# EAGLE schematic interactiveBoard (EAGLE 9.5.2)
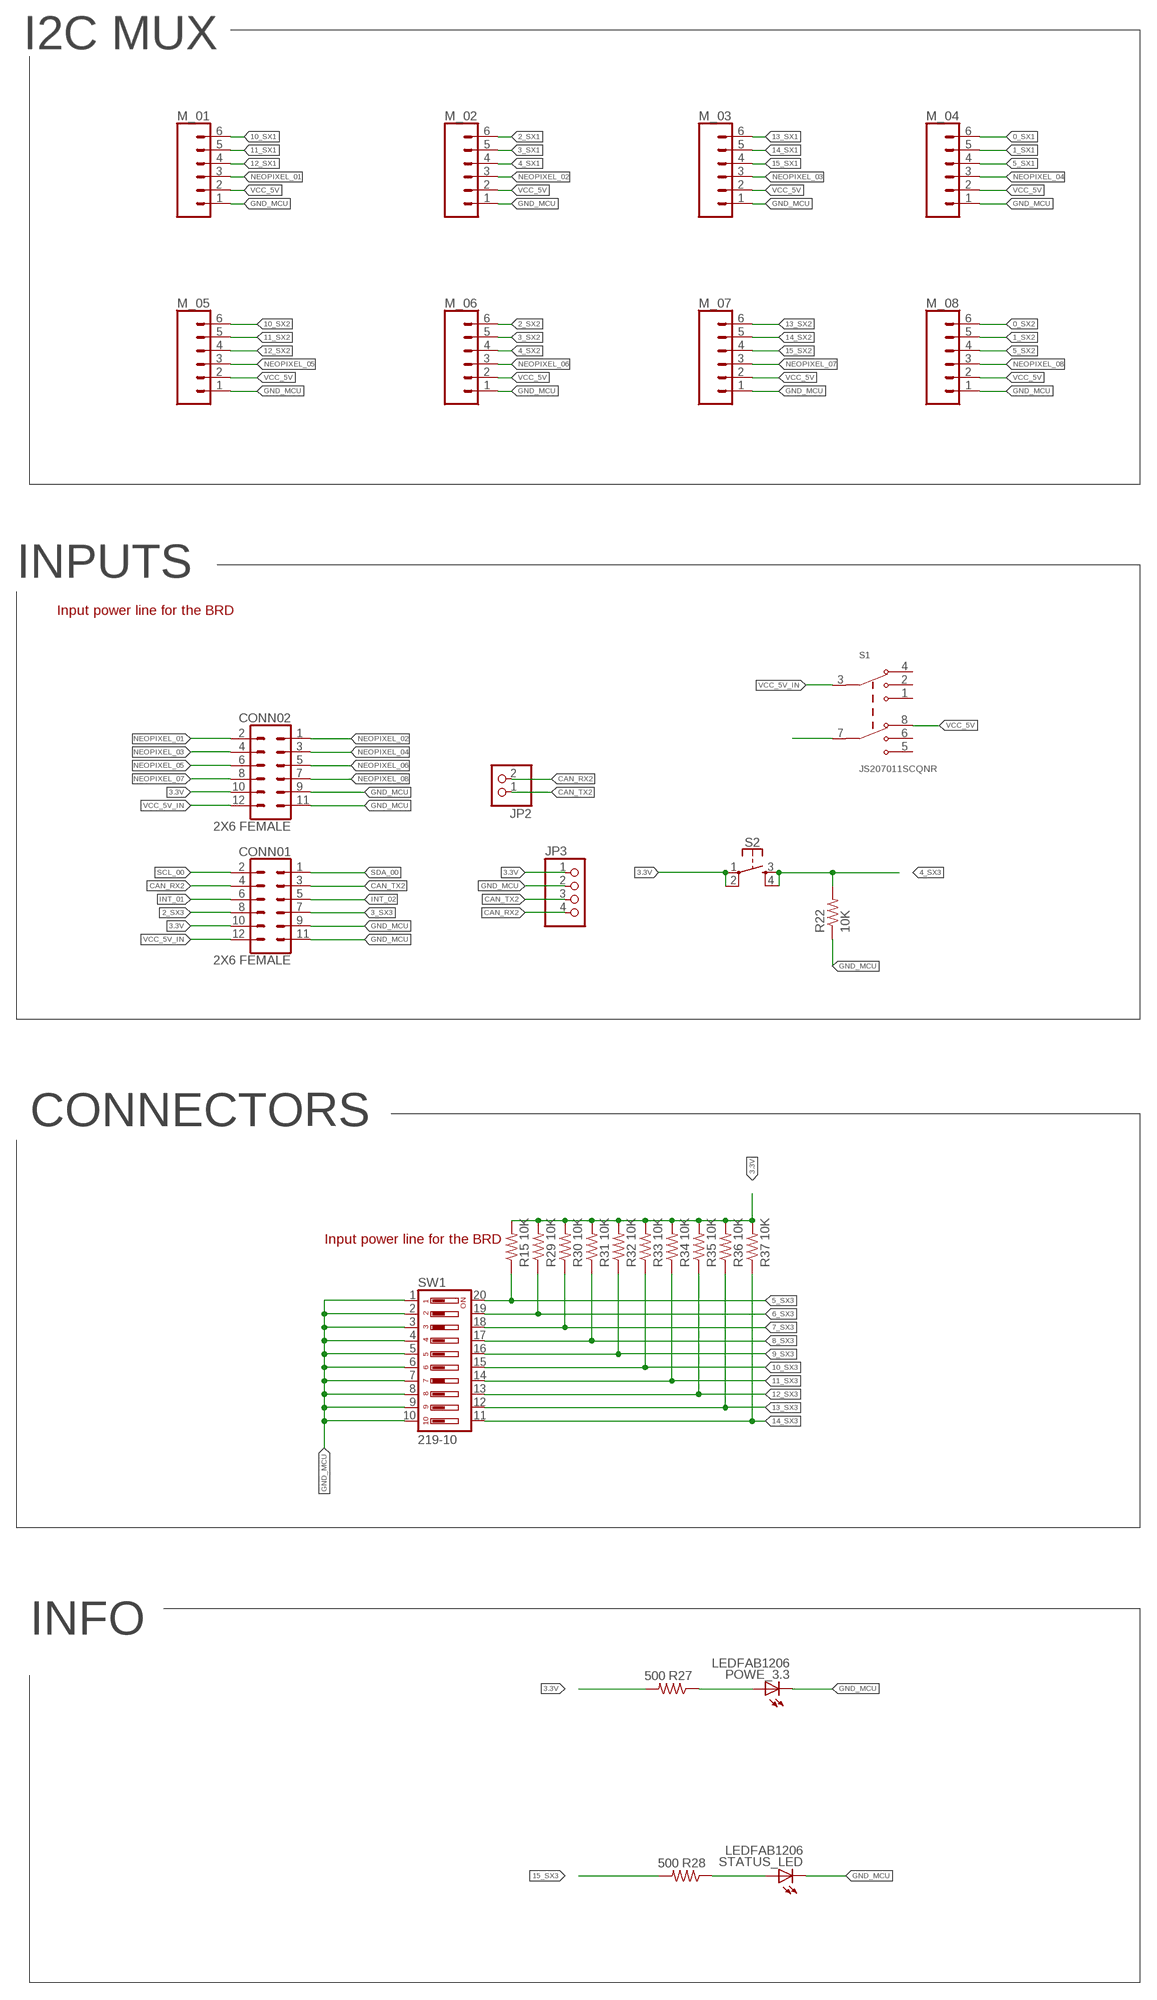
[diagram p0: schematic, sheet 1, part 1 of 2]
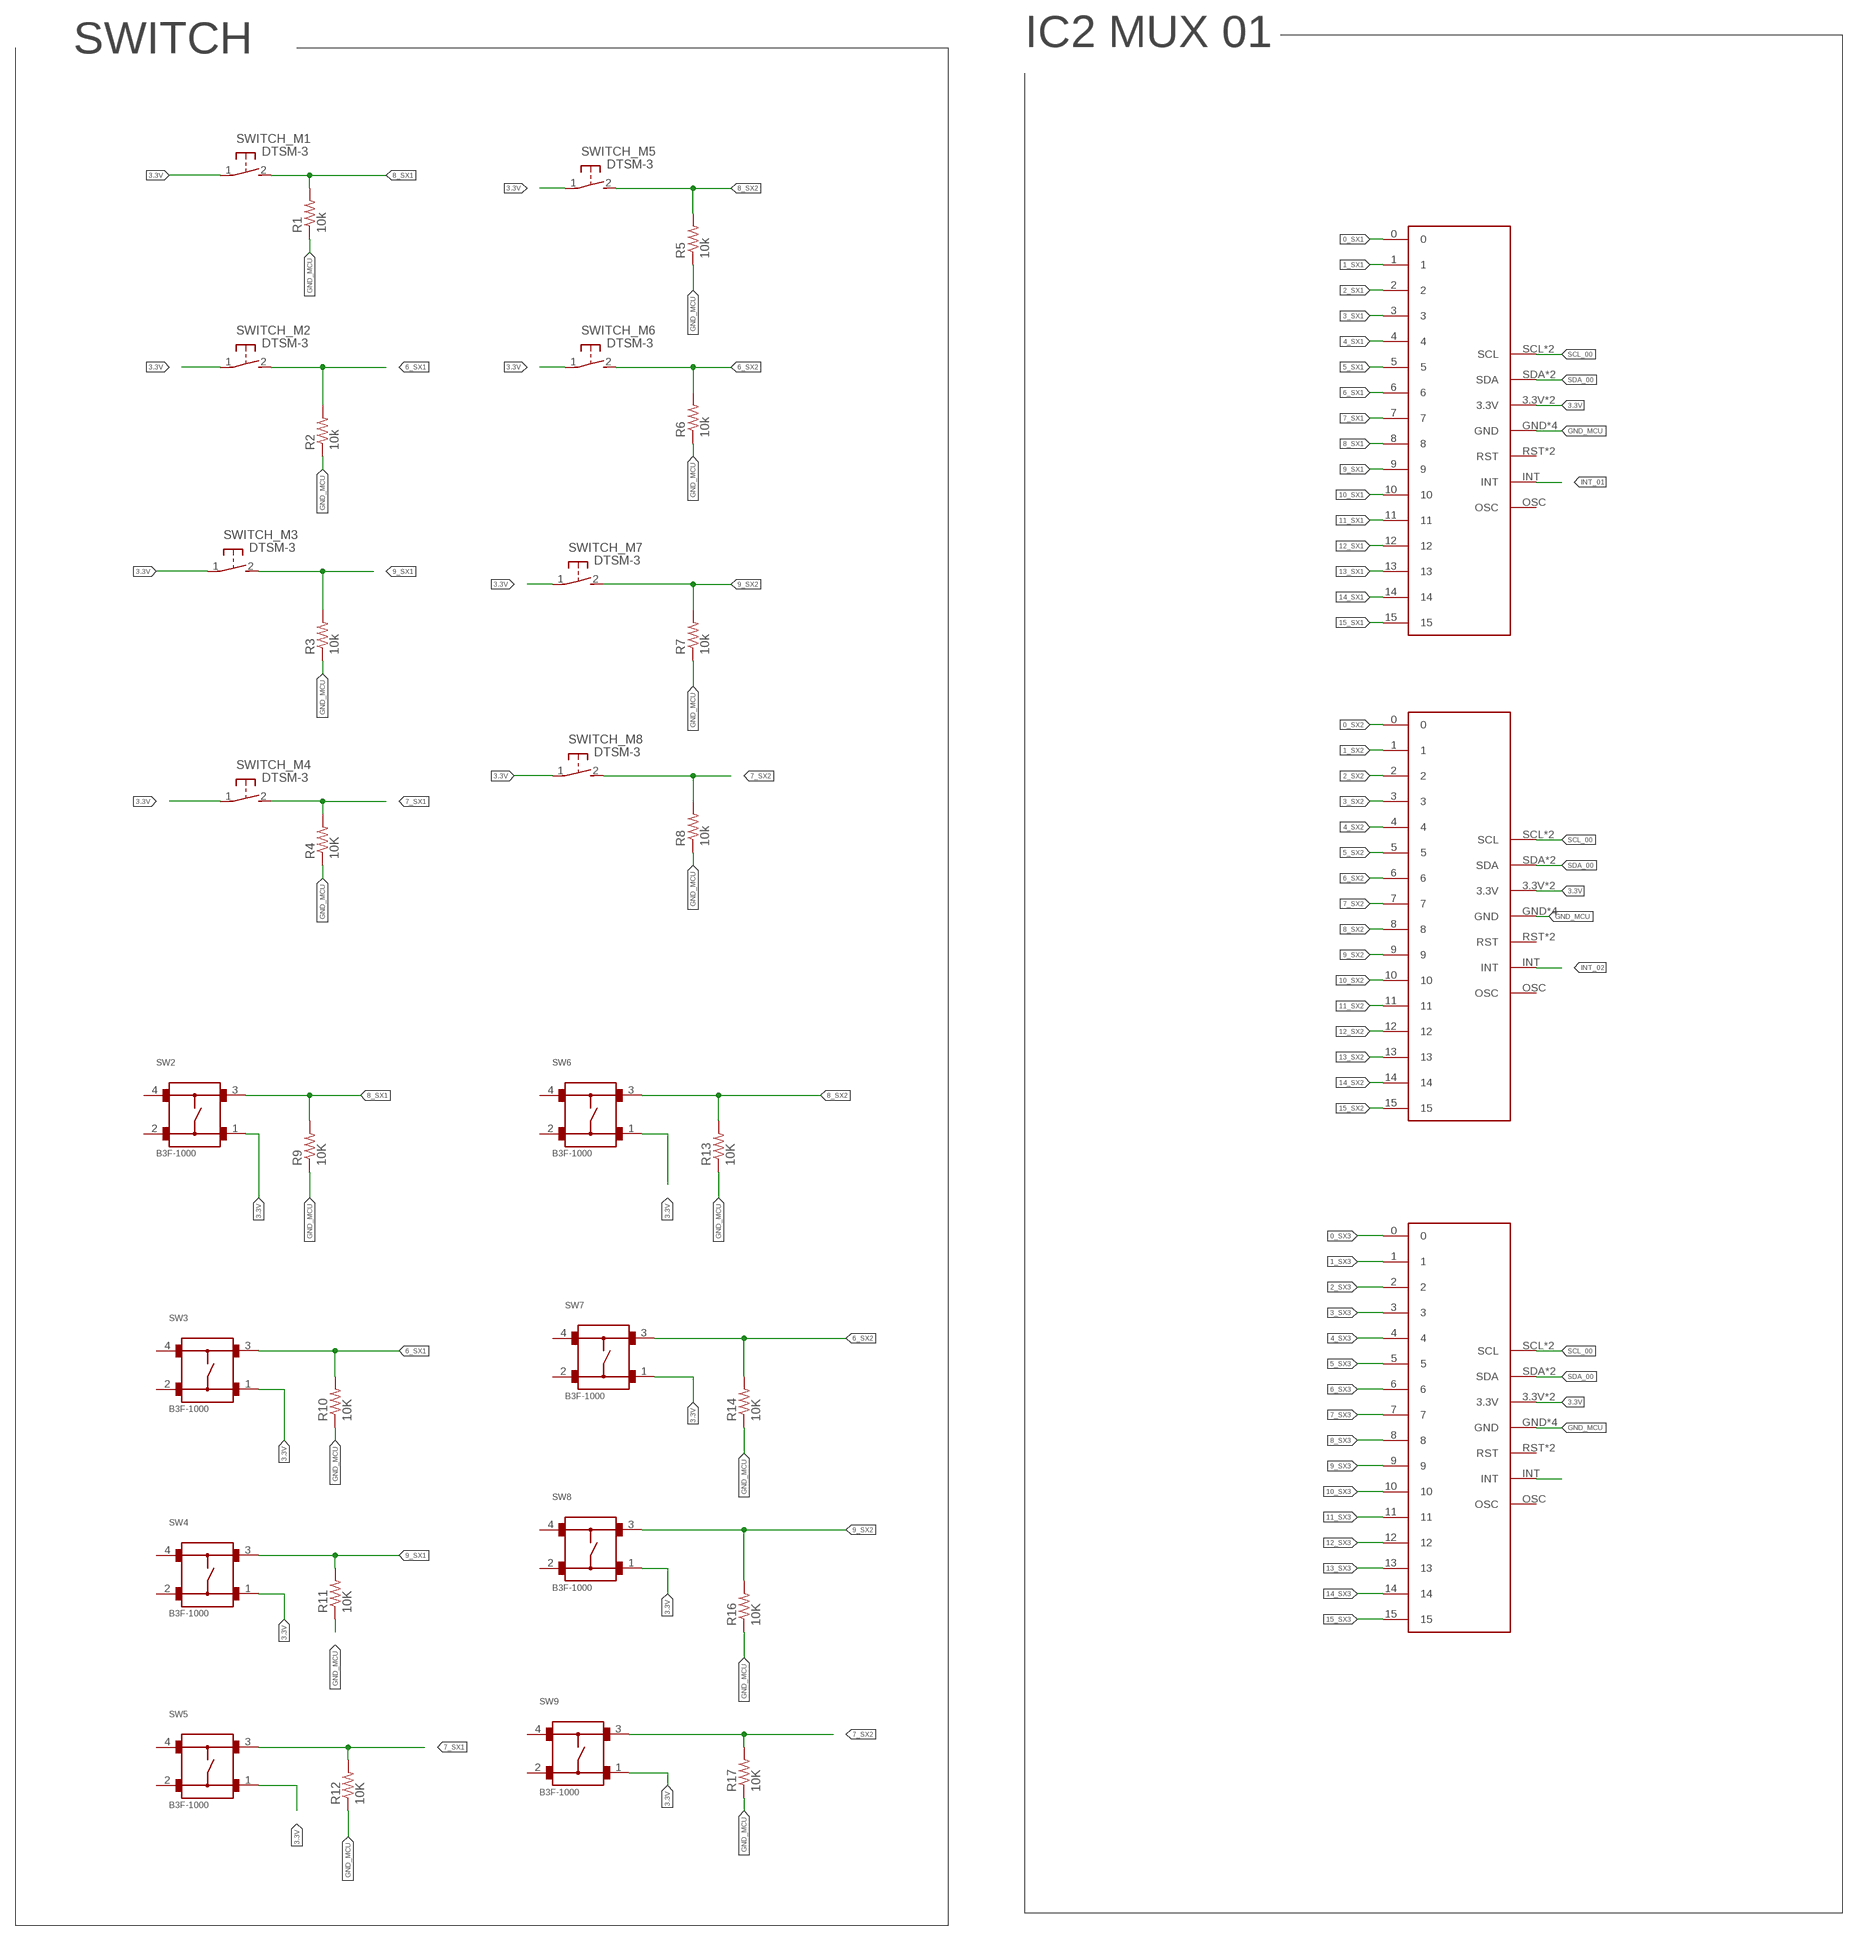
[diagram p1: schematic, sheet 1, part 2 of 2]

## Parts
CONN01  2X6 FEMALE  CONN_06X2PTH_FEMALE  [2X6]
CONN02  2X6 FEMALE  CONN_06X2PTH_FEMALE  [2X6]
JP2  HEADER-1X2ROUND  [1X02_ROUND]
JP3  HEADER-1X4ROUND  [1X04_ROUND]
M_01  CONN_06SMD-1MM  [1X06-1MM]
M_02  CONN_06SMD-1MM  [1X06-1MM]
M_03  CONN_06SMD-1MM  [1X06-1MM]
M_04  CONN_06SMD-1MM  [1X06-1MM]
M_05  CONN_06SMD-1MM  [1X06-1MM]
M_06  CONN_06SMD-1MM  [1X06-1MM]
M_07  CONN_06SMD-1MM  [1X06-1MM]
M_08  CONN_06SMD-1MM  [1X06-1MM]
POWE_3.3  LEDFAB1206  [LED1206FAB]
R1  10k  R-US_M0805  [M0805]
R2  10k  R-US_M0805  [M0805]
R3  10k  R-US_M0805  [M0805]
R4  10K  R-US_M0805  [M0805]
R5  10k  R-US_M0805  [M0805]
R6  10k  R-US_M0805  [M0805]
R7  10k  R-US_M0805  [M0805]
R8  10k  R-US_M0805  [M0805]
R9  10K  R-US_M0805  [M0805]
R10  10K  R-US_M0805  [M0805]
R11  10K  R-US_M0805  [M0805]
R12  10K  R-US_M0805  [M0805]
R13  10K  R-US_M0805  [M0805]
R14  10K  R-US_M0805  [M0805]
R15  10K  10KOHM-1/10W-1%(0603)0603  [0603-RES]
R16  10K  R-US_M0805  [M0805]
R17  10K  R-US_M0805  [M0805]
R22  10K  R-US_M0805  [M0805]
R27  500  10KOHM-1/10W-1%(0603)0603  [0603-RES]
R28  500  10KOHM-1/10W-1%(0603)0603  [0603-RES]
R29  10K  10KOHM-1/10W-1%(0603)0603  [0603-RES]
R30  10K  10KOHM-1/10W-1%(0603)0603  [0603-RES]
R31  10K  10KOHM-1/10W-1%(0603)0603  [0603-RES]
R32  10K  10KOHM-1/10W-1%(0603)0603  [0603-RES]
R33  10K  10KOHM-1/10W-1%(0603)0603  [0603-RES]
R34  10K  10KOHM-1/10W-1%(0603)0603  [0603-RES]
R35  10K  10KOHM-1/10W-1%(0603)0603  [0603-RES]
R36  10K  10KOHM-1/10W-1%(0603)0603  [0603-RES]
R37  10K  10KOHM-1/10W-1%(0603)0603  [0603-RES]
S1  JS207011SCQNR  [SW_JS207011SCQNR]
S2  MOMENTARY-SWITCH-SPST-2-SMD-5.2MM  [TACTILE_SWITCH_SMD_5.2MM]
STATUS_LED  LEDFAB1206  [LED1206FAB]
SW1  219-10  [CTS-219-10]
SW2  B3F-1000  [B3F-1000]
SW3  B3F-1000  [B3F-1000]
SW4  B3F-1000  [B3F-1000]
SW5  B3F-1000  [B3F-1000]
SW6  B3F-1000  [B3F-1000]
SW7  B3F-1000  [B3F-1000]
SW8  B3F-1000  [B3F-1000]
SW9  B3F-1000  [B3F-1000]
SWITCH_M1  DTSM-3  [DTSM-3]
SWITCH_M2  DTSM-3  [DTSM-3]
SWITCH_M3  DTSM-3  [DTSM-3]
SWITCH_M4  DTSM-3  [DTSM-3]
SWITCH_M5  DTSM-3  [DTSM-3]
SWITCH_M6  DTSM-3  [DTSM-3]
SWITCH_M7  DTSM-3  [DTSM-3]
SWITCH_M8  DTSM-3  [DTSM-3]
U$1  SX1509HOLE  [SX1509_HOLE]
U$2  SX1509HOLE  [SX1509_HOLE]
U$3  SX1509HOLE  [SX1509_HOLE]

## Nets
0_SX1: M_04.6 U$1.0
0_SX2: M_08.6 U$2.0
0_SX3: U$3.0
1_SX1: M_04.5 U$1.1
1_SX2: M_08.5 U$2.1
1_SX3: U$3.1
2_SX1: M_02.6 U$1.2
2_SX2: M_06.6 U$2.2
2_SX3: CONN01.8 U$3.2
3.3V [3v]: CONN01.10 CONN02.10 JP3.1 R15.2 R27.2 R29.2 R30.2 R31.2 R32.2 R33.2 R34.2 R35.2 R36.2 R37.2 S2.1 S2.2 SW2.1 SW3.1 SW4.1 SW5.1 SW6.1 SW7.1 SW8.1 SW9.1 SWITCH_M1.1 SWITCH_M2.1 SWITCH_M3.1 SWITCH_M4.1 SWITCH_M5.1 SWITCH_M6.1 SWITCH_M7.1 SWITCH_M8.1 U$1.3.3V U$1.3.3V_2(3.3V) U$2.3.3V U$2.3.3V_2(3.3V) U$3.3.3V U$3.3.3V_2(3.3V)
3_SX1: M_02.5 U$1.3
3_SX2: M_06.5 U$2.3
3_SX3: CONN01.7 U$3.3
4_SX1: M_02.4 U$1.4
4_SX2: M_06.4 U$2.4
4_SX3: R22.2 S2.3 S2.4 U$3.4
5_SX1: M_04.4 U$1.5
5_SX2: M_08.4 U$2.5
5_SX3: R15.1 SW1.20 U$3.5
6_SX1: R2.2 R10.2 SW3.3 SWITCH_M2.2 U$1.6
6_SX2: R6.2 R14.2 SW7.3 SWITCH_M6.2 U$2.6
6_SX3: R29.1 SW1.19 U$3.6
7_SX1: R4.2 R12.2 SW5.3 SWITCH_M4.2 U$1.7
7_SX2: R8.2 R17.2 SW9.3 SWITCH_M8.2 U$2.7
7_SX3: R30.1 SW1.18 U$3.7
8_SX1: R1.2 R9.2 SW2.3 SWITCH_M1.2 U$1.8
8_SX2: R5.2 R13.2 SW6.3 SWITCH_M5.2 U$2.8
8_SX3: R31.1 SW1.17 U$3.8
9_SX1: R3.2 R11.2 SW4.3 SWITCH_M3.2 U$1.9
9_SX2: R7.2 R16.2 SW8.3 SWITCH_M7.2 U$2.9
9_SX3: R32.1 SW1.16 U$3.9
10_SX1: M_01.6 U$1.10
10_SX2: M_05.6 U$2.10
10_SX3: R33.1 SW1.15 U$3.10
11_SX1: M_01.5 U$1.11
11_SX2: M_05.5 U$2.11
11_SX3: R34.1 SW1.14 U$3.11
12_SX1: M_01.4 U$1.12
12_SX2: M_05.4 U$2.12
12_SX3: R35.1 SW1.13 U$3.12
13_SX1: M_03.6 U$1.13
13_SX2: M_07.6 U$2.13
13_SX3: R36.1 SW1.12 U$3.13
14_SX1: M_03.5 U$1.14
14_SX2: M_07.5 U$2.14
14_SX3: R37.1 SW1.11 U$3.14
15_SX1: M_03.4 U$1.15
15_SX2: M_07.4 U$2.15
15_SX3: R28.2 U$3.15
CAN_RX2: CONN01.4 JP2.2 JP3.4
CAN_TX2: CONN01.3 JP2.1 JP3.3
GND_MCU: CONN01.9 CONN01.11 CONN02.9 CONN02.11 JP3.2 M_01.1 M_02.1 M_03.1 M_04.1 M_05.1 M_06.1 M_07.1 M_08.1 POWE_3.3.2(C) R1.1 R2.1 R3.1 R4.1 R5.1 R6.1 R7.1 R8.1 R9.1 R10.1 R11.1 R12.1 R13.1 R14.1 R16.1 R17.1 R22.1 STATUS_LED.2(C) SW1.1 SW1.2 SW1.3 SW1.4 SW1.5 SW1.6 SW1.7 SW1.8 SW1.9 SW1.10 U$1.GND U$1.GND_1(GND) U$1.GND_2(GND) U$1.GND_3(GND) U$2.GND U$2.GND_1(GND) U$2.GND_2(GND) U$2.GND_3(GND) U$3.GND U$3.GND_1(GND) U$3.GND_2(GND) U$3.GND_3(GND)
INT_01: CONN01.6 U$1.INT
INT_02: CONN01.5 U$2.INT
N$1: S1.7
N$13: R28.1 STATUS_LED.1(A)
N$25: U$3.INT
N$193: POWE_3.3.1(A) R27.1
NEOPIXEL_01: CONN02.2 M_01.3
NEOPIXEL_02: CONN02.1 M_02.3
NEOPIXEL_03: CONN02.4 M_03.3
NEOPIXEL_04: CONN02.3 M_04.3
NEOPIXEL_05: CONN02.6 M_05.3
NEOPIXEL_06: CONN02.5 M_06.3
NEOPIXEL_07: CONN02.8 M_07.3
NEOPIXEL_08: CONN02.7 M_08.3
SCL_00: CONN01.2 U$1.SCL U$1.SCL_2(SCL) U$2.SCL U$2.SCL_2(SCL) U$3.SCL U$3.SCL_2(SCL)
SDA_00: CONN01.1 U$1.SDA U$1.SDA_2(SDA) U$2.SDA U$2.SDA_2(SDA) U$3.SDA U$3.SDA_2(SDA)
VCC_5V [5v]: M_01.2 M_02.2 M_03.2 M_04.2 M_05.2 M_06.2 M_07.2 M_08.2 S1.8
VCC_5V_IN [5v]: CONN01.12 CONN02.12 S1.3
Unconnected: S1.1 S1.2 S1.4 S1.5 S1.6 SW2.2 SW2.4 SW3.2 SW3.4 SW4.2 SW4.4 SW5.2 SW5.4 SW6.2 SW6.4 SW7.2 SW7.4 SW8.2 SW8.4 SW9.2 SW9.4 U$1.OSC U$1.RST U$1.RST_2(RST) U$2.OSC U$2.RST U$2.RST_2(RST) U$3.OSC U$3.RST U$3.RST_2(RST)

## Notes on the sheet
- SWITCH | IC2 MUX 01
- I2C MUX
- INPUTS
- Input power line for the BRD
- CONNECTORS
- Input power line for the BRD
- INFO

## Library data of the parts
CONN01 CONN02 = SparkFun-Connectors:CONN_06X2: Multi connection point. Often used as Generic Header-pin footprint for 0.1 inch spaced/style header connections On any of the 0.1 inch spaced packages, you can populate with these: Break Away Headers - Straight <https://www.sparkfun.com/products/116> (PRT-00116) Break Away Male Headers - Right Angle <https://www.sparkfun.com/products/553> (PRT-00553) Female Headers <https://www.sparkfun.com/products/115> (PRT-00115) Break Away Headers - Machine Pin <https://www.sparkfun.com/products/117> (PRT-00117) Break Away Female Headers - Swiss Machine Pin <https://www.sparkfun.com/products/743> (PRT-00743); PROD_ID: CONN-12423
JP2 = microbuilder:HEADER-1X2: PIN HEADER
JP3 = microbuilder:HEADER-1X4: PIN HEADER
M_01-M_08 = SparkFun-Connectors:CONN_06: Multi connection point. Often used as Generic Header-pin footprint for 0.1 inch spaced/style header connections On any of the 0.1 inch spaced packages, you can populate with these: Break Away Headers - Straight <https://www.sparkfun.com/products/116> (PRT-00116) Break Away Male Headers - Right Angle <https://www.sparkfun.com/products/553> (PRT-00553) Female Headers <https://www.sparkfun.com/products/115> (PRT-00115) Break Away Headers - Machine Pin <https://www.sparkfun.com/products/117> (PRT-00117) Break Away Female Headers - Swiss Machine Pin <https://www.sparkfun.com/products/743> (PRT-00743) Arduino Stackable Header - 6 Pin <https://www.sparkfun.com/products/9280> (PRT-09280) For SCREWTERMINALS and SPRING TERMINALS visit here: Screw Terimnals on SparkFun.com <https://www.sparkfun.com/search/results?term=Screw+Terminals> (5mm/3.5mm/2.54mm spacing) This device is also useful as a general connection point to wire up your design to another part of your project. Our various solder wires solder well into these plated through hole pads. Hook-Up Wire - Assortment (Stranded, 22 AWG) <https://www.sparkfun.com/products/11375> (PRT-11375) Hook-Up Wire - Assortment (Solid Core, 22 AWG) <https://www.sparkfun.com/products/11367> (PRT-11367) View the entire wire category on our website here <https://www.sparkfun.com/categories/141>; PROD_ID: CONN-08249; SF_ID: GPS-00579
POWE_3.3 STATUS_LED = fab:LED: LED
R1-R14 R16 R17 R22 = resistor:R-US_: RESISTOR, American symbol
R15 R29-R37 = SparkFun-Resistors:10KOHM-1/10W-1%(0603): RES-00824; PROD_ID: RES-00824
R27 R28 = SparkFun-Resistors:10KOHM-1/10W-1%(0603): RES-00824; PROD_ID: RES-00824; VALUE: 10K
S1 = JS207011SCQNR:JS207011SCQNR: Js Series Sub-Miniature Slide Switches; AVAILABILITY: Unavailable; DESCRIPTION: Slide Switch DP3T Surface Mount; MF: C&K; MP: JS207011SCQNR; PACKAGE: None; PRICE: None
S2 = SparkFun-Switches:MOMENTARY-SWITCH-SPST-2: Momentary Switch (Pushbutton) - SPST - Two Circuits Normally-open (NO) SPST momentary switches (buttons, pushbuttons). Schematic symbol includes two switch circuits. Variants SMD-4.6MMX2.8MM - 4.60mm x 2.80mm Tactile Momentary Button Switch - Used on SparkFun SAMD21 Mini Breakout <https://www.sparkfun.com/products/13664> SMD-5.2MM - Mini Pushbutton Switch - SMD <https://www.sparkfun.com/products/8720> - Used on Arduino Pro Mini <https://www.sparkfun.com/products/11114>; PROD_ID: SWCH-08247; SF_SKU: COM-08720
SW1 = switch-dil:219-10*: Surface Mount DIP Switch Series 219 SMT CTS Electronic Components Sourc: www.ctscorp.com; MF: SLI (CML/IDI); MPN: 219-10PK; OC_FARNELL: unknown; OC_NEWARK: 19M0224
SW2-SW9 = Switch:B3F-1000: Tactile Switch SPST-NO Top Actuated Through Hole Manufacturer's datasheet <https://omronfs.omron.com/en_US/ecb/products/pdf/en-b3f.pdf>; CREATED_BY: PCBLayout.com; DIGI_KEY_PART_NUMBER: SW400-ND; MANUFACTURER: Omron Electronics Inc-EMC Div; MPN: B3F-1000; PACKAGE: SPST-NO
SWITCH_M1-SWITCH_M8 = switch-tact:DTSM-3
U$1-U$3 = SX1509_s:SX1509

## Net classes
0 default: width 0.2 mm, clearance 0.2 mm
1 gnd: width 0.2 mm, clearance 0.2 mm
2 3v: width 0.45 mm, clearance 0.2 mm
4 5v: width 0.45 mm, clearance 0.2 mm